# Altium schematic sheet AQCA-Control-Power-B0.SchDoc
size A4
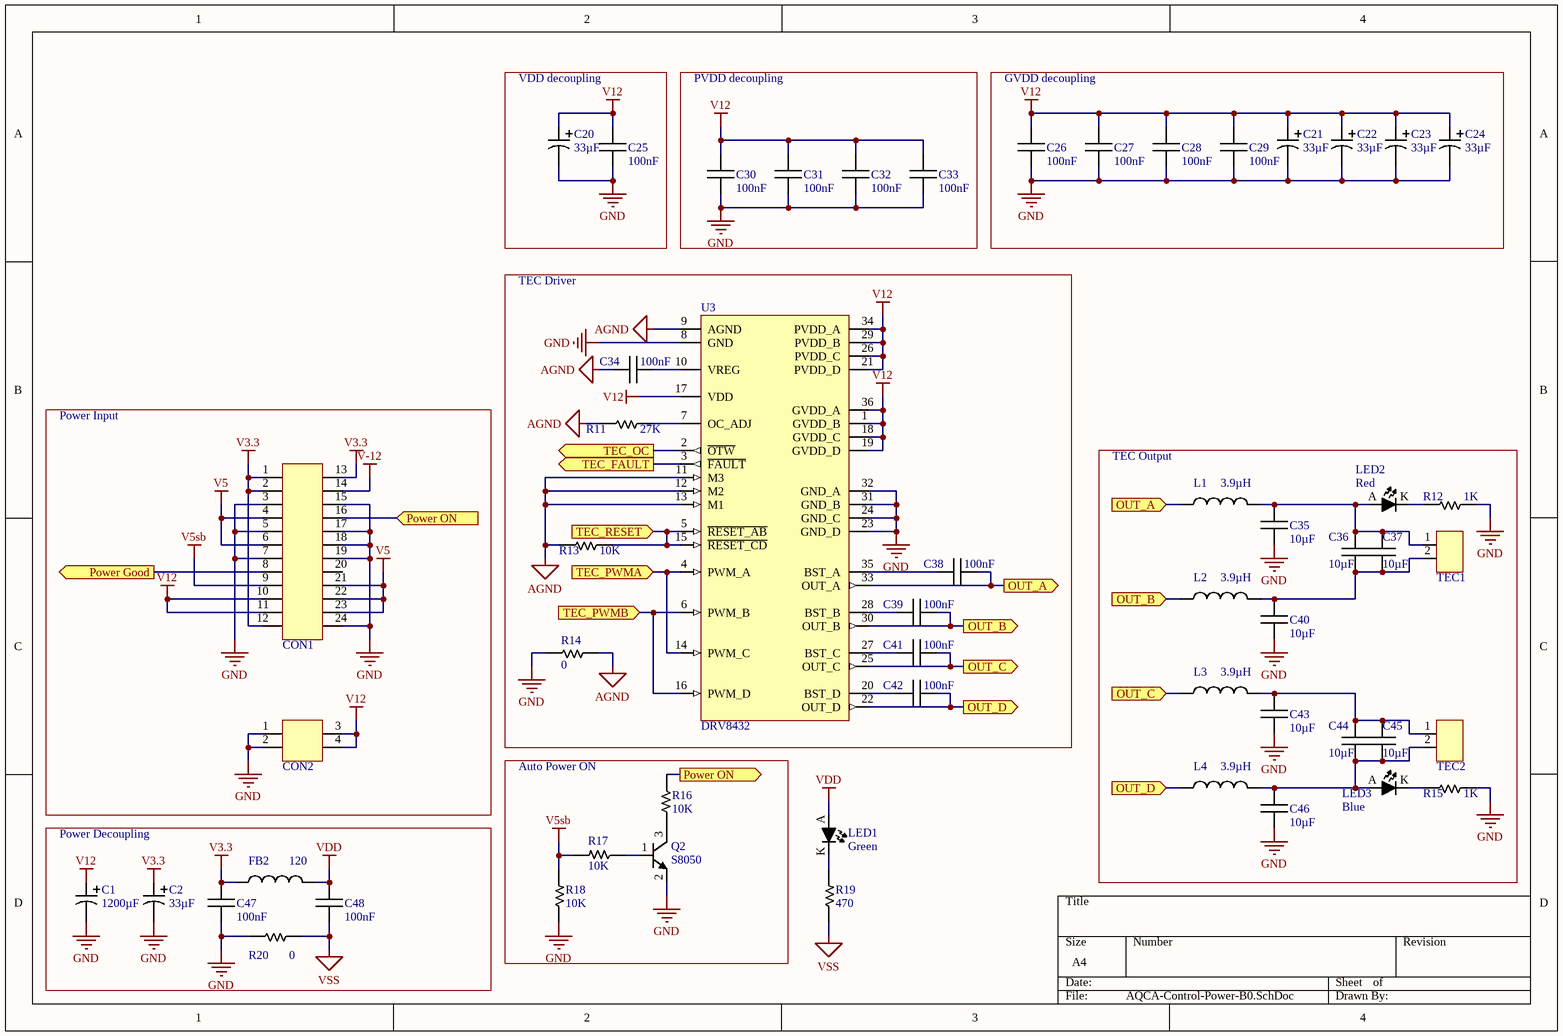
[diagram p0: AQCA-Control-Power-B0.SchDoc]

## Parts
C1  1200µF  [CAPPR7.5-18x35.5]
C2  33µF  [CAPPR2-5x11]
C20  33µF  [CAPPR2-5x11]
C21  33µF  [CAPPR2-5x11]
C22  33µF  [CAPPR2-5x11]
C23  33µF  [CAPPR2-5x11]
C24  33µF  [CAPPR2-5x11]
C25  100nF  [CAPC1608N]
C26  100nF  [CAPC1608N]
C27  100nF  [CAPC1608N]
C28  100nF  [CAPC1608N]
C29  100nF  [CAPC1608N]
C30  100nF  [CAPC1608N]
C31  100nF  [CAPC1608N]
C32  100nF  [CAPC1608N]
C33  100nF  [CAPC1608N]
C34  100nF  [CAPC1608N]
C35  10µF  [CAPC3225N]
C36  10µF  [CAPC3225N]
C37  10µF  [CAPC3225N]
C38  100nF  [CAPC1608N]
C39  100nF  [CAPC1608N]
C40  10µF  [CAPC3225N]
C41  100nF  [CAPC1608N]
C42  100nF  [CAPC1608N]
C43  10µF  [CAPC3225N]
C44  10µF  [CAPC3225N]
C45  10µF  [CAPC3225N]
C46  10µF  [CAPC3225N]
C47  100nF  [CAPC1608N]
C48  100nF  [CAPC1608N]
CON1  Molex Mini-Fit 24pin  [Molex Mini-Fit 24pin 90deg]  (value not drawn)
CON2  Molex Mini-Fit 4pin  [Molex Mini-Fit 4pin 90deg]  (value not drawn)
FB2  120  [INDC1608N]
L1  3.9µH  [Inductor AIUR5-6]
L2  3.9µH  [Inductor AIUR5-6]
L3  3.9µH  [Inductor AIUR5-6]
L4  3.9µH  [Inductor AIUR5-6]
LED1  Green  [LED 3216m]
LED2  Red  [LED 3216m]
LED3  Blue  [LED 3216m]
Q2  S8050  [SOT23_N]
R11  27K  [RESC1608N]
R12  1K  [RESC1608N]
R13  10K  [RESC1608N]
R14  0  [RESC1608N]
R15  1K  [RESC1608N]
R16  10K  [RESC1608N]
R17  10K  [RESC1608N]
R18  10K  [RESC1608N]
R19  470  [RESC1608N]
R20  0  [RESC1608N]
TEC1  High-Power Connector 2p  [High-Power Connector 2]  (value not drawn)
TEC2  High-Power Connector 2p  [High-Power Connector 2]  (value not drawn)
U3  DRV8432  [PSOP3-36]

## Blocks framed on the sheet
VDD decoupling: C20 C25
PVDD decoupling: C30-C33
GVDD decoupling: C21-C24 C26-C29
TEC Driver: C34 C38 C39 C41 C42 R11 R13 R14 U3
Power Input: CON1 CON2
TEC Output: C35-C37 C40 C43-C46 L1-L4 LED2 LED3 R12 R15 TEC1 TEC2
Auto Power ON: Q2 R16-R18
Power Decoupling: C1 C2 C47 C48 FB2 R20

## Ports
OUT_A (in), OUT_A (out), OUT_B (in), OUT_B (out), OUT_C (in), OUT_C (out), OUT_D (in), OUT_D (out), Power Good (out), Power ON (in), Power ON (out), TEC_FAULT (out), TEC_OC (out), TEC_PWMA (in), TEC_PWMB (in), TEC_RESET (in)

## Nets
AGND: C34.2 R11.1 R13.1 R14.2 U3.9(AGND) U3.11(M3) U3.12(M2) U3.13(M1)
GND: C1.2 C2.2 C20.2 C21.2 C22.2 C23.2 C24.2 C25.1 C26.1 C27.1 C28.1 C29.1 C30.1 C31.1 C32.1 C33.1 C35.1 C40.1 C43.1 C46.1 C47.2 CON1.3 CON1.5 CON1.7 CON1.15 CON1.17 CON1.18 CON1.19 CON1.24 CON2.1 CON2.2 Q2.2(E) R12.2 R14.1 R15.2 R18.1 R20.1 U3.8(GND) U3.23(GND_D) U3.24(GND_C) U3.31(GND_B) U3.32(GND_A)
V3.3: C2.1 C47.1 CON1.1 CON1.2 CON1.12 CON1.13 FB2.1
V5: CON1.4 CON1.6 CON1.21 CON1.22 CON1.23
V5sb: CON1.9 R17.2 R18.2
V12: C1.1 C20.1 C21.1 C22.1 C23.1 C24.1 C25.2 C26.2 C27.2 C28.2 C29.2 C30.2 C31.2 C32.2 C33.2 CON1.10 CON1.11 CON2.3 CON2.4 U3.1(GVDD_B) U3.17(VDD) U3.18(GVDD_C) U3.19(GVDD_D) U3.21(PVDD_D) U3.26(PVDD_C) U3.29(PVDD_B) U3.34(PVDD_A) U3.36(GVDD_A)
V-12: CON1.14
VDD: C48.1 FB2.2 LED1.A
VSS: C48.2 R19.1 R20.2
OUT_A: C38.2 L1.1 U3.33(OUT_A) ; port OUT_A
OUT_B: C39.2 L2.1 U3.30(OUT_B) ; port OUT_B
OUT_C: C41.2 L3.1 U3.25(OUT_C) ; port OUT_C
OUT_D: C42.2 L4.1 U3.22(OUT_D) ; port OUT_D
Power Good: CON1.8 ; port Power Good
Power ON: CON1.16 R16.1 ; port Power ON
TEC_FAULT: U3.3(~{FAULT}) ; port TEC_FAULT
TEC_OC: U3.2(~{OTW}) ; port TEC_OC
TEC_PWMA: U3.4(PWM_A) U3.14(PWM_C) ; port TEC_PWMA
TEC_PWMB: U3.6(PWM_B) U3.16(PWM_D) ; port TEC_PWMB
TEC_RESET: R13.2 U3.5(~{RESET_AB}) U3.15(~{RESET_CD}) ; port TEC_RESET
NetC34_1: C34.1 U3.10(VREG)
NetC35_2: C35.2 C36.2 C37.2 L1.2 LED2.A TEC1.1
NetC36_1: C36.1 C37.1 C40.2 L2.2 TEC1.2
NetC38_1: C38.1 U3.35(BST_A)
NetC39_1: C39.1 U3.28(BST_B)
NetC41_1: C41.1 U3.27(BST_C)
NetC42_1: C42.1 U3.20(BST_D)
NetC43_2: C43.2 C44.2 C45.2 L3.2 TEC2.1
NetC44_1: C44.1 C45.1 C46.2 L4.2 LED3.A TEC2.2
NetLED1_K: LED1.K R19.2
NetLED2_K: LED2.K R12.1
NetLED3_K: LED3.K R15.1
NetQ2_1: Q2.1(B) R17.1
NetQ2_3: Q2.3(C) R16.2
NetR11_2: R11.2 U3.7(OC_ADJ)

Not connected (* = marked no-connect by the designer): CON1 20

## Library data of the parts
C1 = Capacitor Polarised: Voltage Rating: 25V; Value: 1200µF
C2 C20-C24 = Capacitor Polarised: Voltage Rating: 50V; Value: 33µF
C25-C34 C38 C39 C41 C42 C47 C48 = Capacitor: Voltage: 25V; Value: 100nF
C35-C37 C40 C43-C46 = Capacitor: Value: 10µF
FB2 = Inductor: DC Current: 700mA; Value: 120
L1-L4 = Inductor: Value: 3.9µH
LED1 = LED: Vf: 3.2V; If: 20mA; Color: Green
LED2 LED3 = LED
  LED2: Color: Red
  LED3: Color: Blue
Q2 = NPN: pin to pad: 1>3 3>1; Model: S8050
R11-R20 = Resistor
  R11: Value: 27K
  R12 R15: Value: 1K
  R13 R16-R18: Value: 10K
  R14 R20: Value: 0
  R19: Value: 470